# EAGLE design Enclosure 100x68 PBC-AW2 (EAGLE 9.6.1)
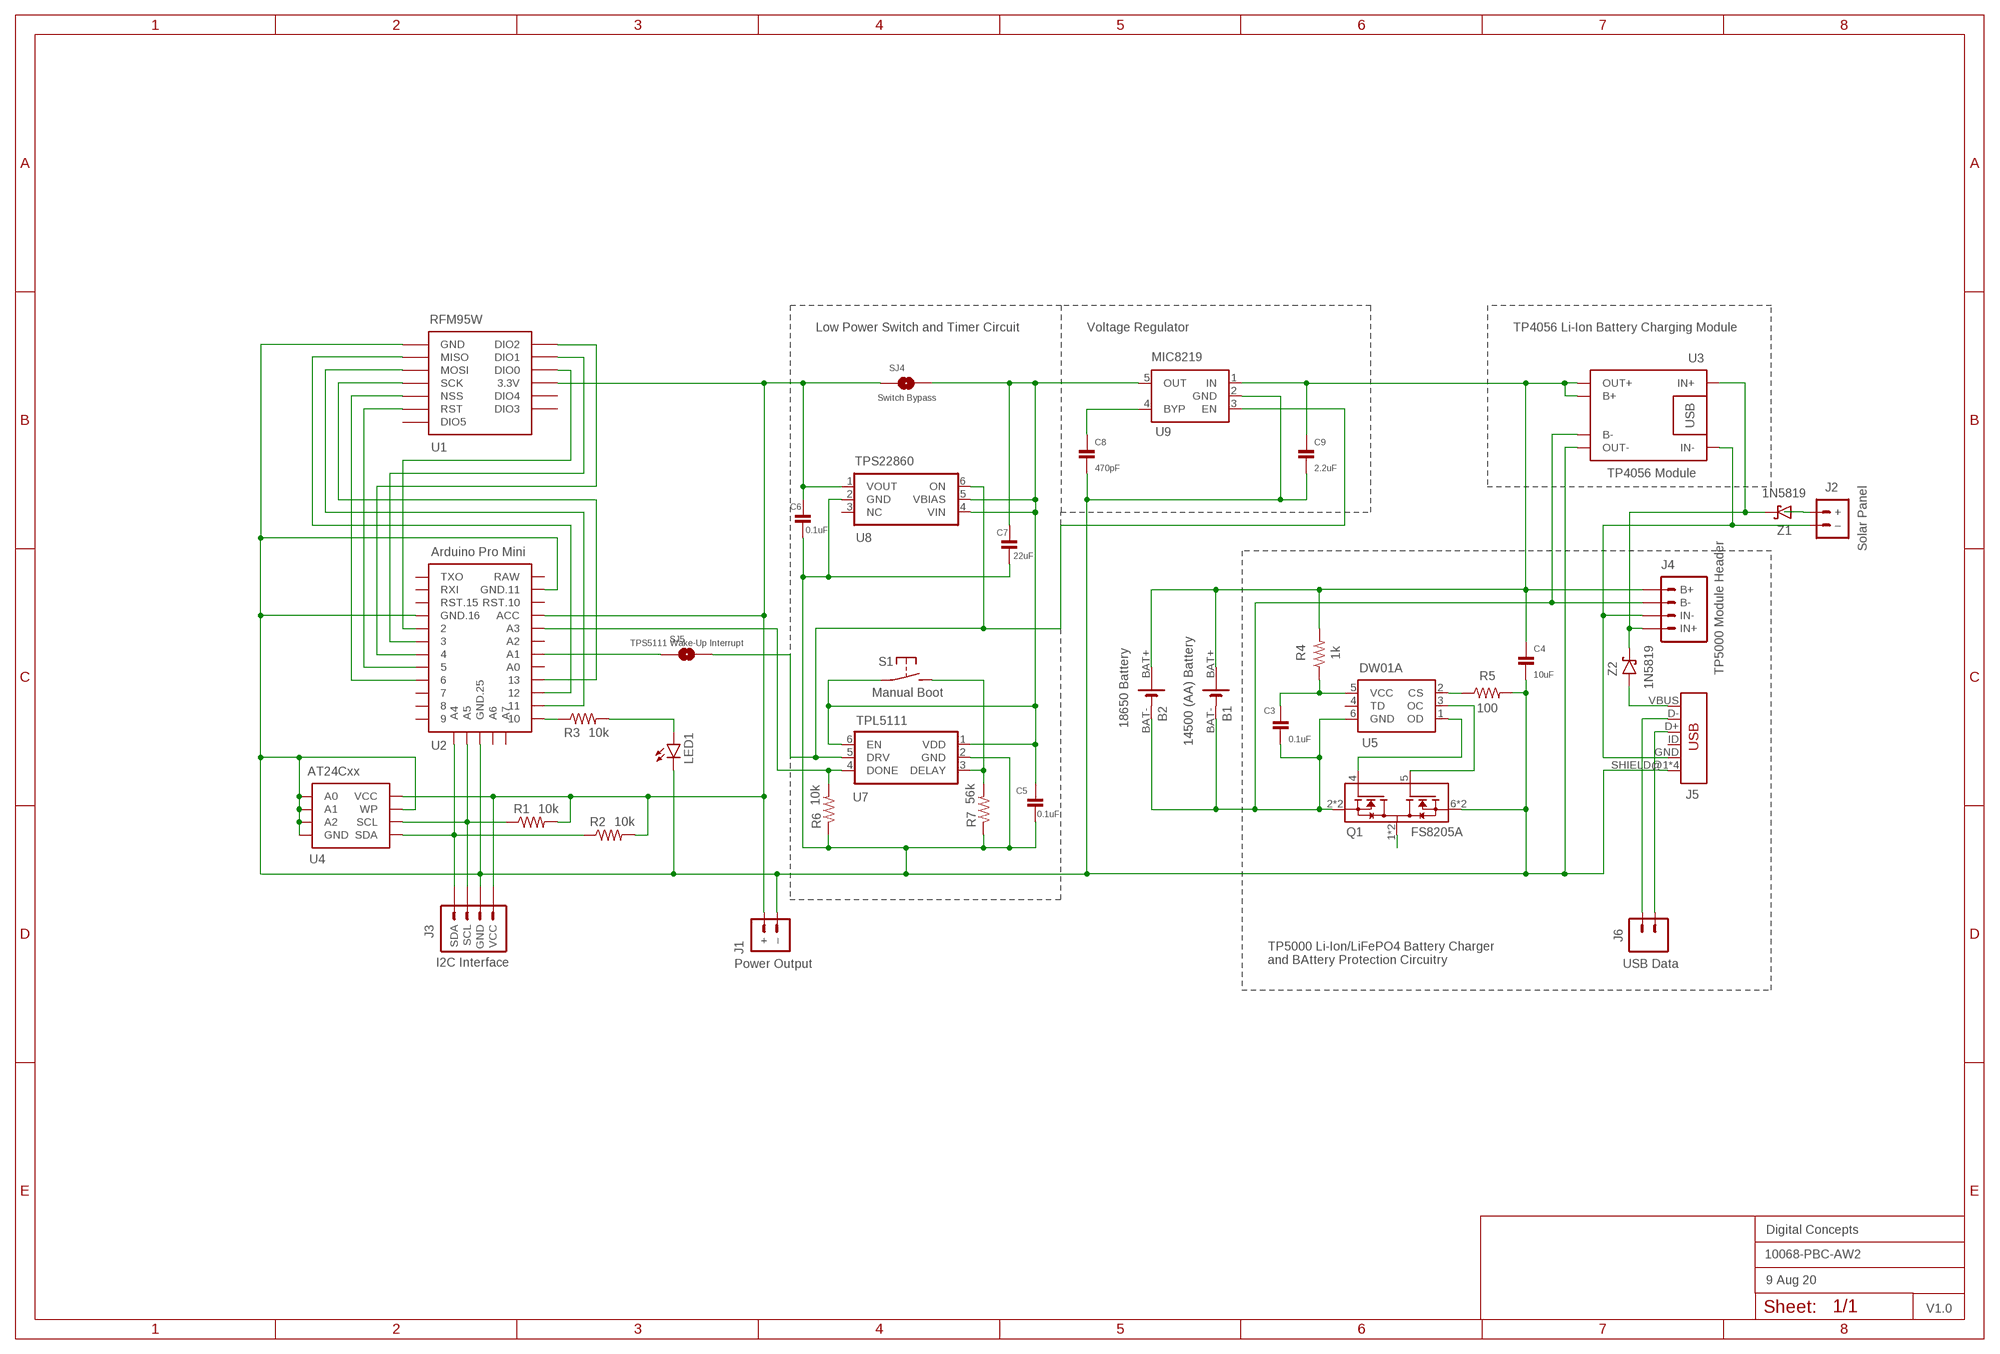
[diagram p0: schematic, sheet 1]
FRAME2 (A3L-LOC): DATE: 9 Aug 20; OWNER: Digital Concepts; TITLE: 10068-PBC-AW2; VERSION: V1.0

## Parts
B1  14500 (AA) Battery  BATTERY-HOLDER-14500(AA)  [BATTERY-14500]
B2  18650 Battery  BATTERY-HOLDER-18650  [BATTERY-18650]
C3  0.1uF  CAPACITOR  [C0805]
C4  10uF  CAPACITOR  [C0805]
C5  0.1uF  CAPACITOR  [C0805]
C6  0.1uF  CAPACITOR  [C0805]
C7  22uF  CAPACITOR  [C0805]
C8  470pF  CAPACITOR  [C0805]
C9  2.2uF  CAPACITOR  [C0805]
J1  Power Output  JST-PH1.25-MALE  [JST-PH1.25]
J2  Solar Panel  JST-PH2.0-MALE  [JST-PH2.0]
J3  I2C Interface  I2C-PIN-HEADER  [CONN_04-GENERIC]
J4  TP5000 Module Header  TP5000-MODULE  [CONN_04-GENERIC]
J5  USB  USB_MINI-B_SMT  [USB-MINIB]
J6  USB Data  1X2-PIN-HEADER  [CONN_02-GENERIC]
LED1  LEDCHIP-LED0805  [CHIP-LED0805]
Q1  FS8205A  [SOP65P640X120-8N]
R1  10k  RESISTORR0805  [R0805]
R2  10k  RESISTORR0805  [R0805]
R3  10k  RESISTORR0805  [R0805]
R4  1k  RESISTORR0805  [R0805]
R5  100  RESISTORR0805  [R0805]
R6  10k  RESISTORR0805  [R0805]
R7  56k  RESISTORR0805  [R0805]
S1  Manual Boot  2-PIN-MOMENTARY-SWITCH  [2-PAD-SWITCH]
SJ4  Switch Bypass  SJ  [SJ]
SJ5  TPS5111 Wake-Up Interrupt  SJ  [SJ]
U1  RFM95W  RFM95W-PI  [RFM95W-PI]
U2  Arduino Pro Mini  ARDUINO-PRO-MINI  [PRO-MINI-29]
U3  TP4056 Module  BATTERY-CHARGER-LI-PROT  [BATTERY-CHARGER-LI-PROT]
U4  AT24Cxx  AT24CXX-EEPROM  [SOP-8]
U5  DW01A  [SOT23-6]
U7  TPL5111  TPL5111DDCR  [SOT-23-6]
U8  TPS22860  [SOT-23-6]
U9  MIC8219  MIC5219XX  [SOT-23-5]
Z1  1N5819  1N5819-SOD-123  [SOD-123]
Z2  1N5819  1N5819-SOD-123  [SOD-123]

## Nets
GND: C4.2 C5.2 C6.2 C7.2 C8.2 C9.2 J1.-(–) J3.2(GND) J5.SHIELD@1(SHIELD) J5.SHIELD@2(SHIELD) J5.SHIELD@3(SHIELD) J5.SHIELD@4(SHIELD) LED1.C Q1.6(S2) Q1.7(S2) R5.2 R6.1 R7.1 U1.GND@3(GND) U1.GND@6(GND) U2.GND@11(GND.25) U2.GND@16(GND.16) U2.GND@25(GND.11) U3.OUT- U4.P$1(A0) U4.P$2(A1) U4.P$3(A2) U4.P$4(GND) U4.P$7(WP) U7.2(GND) U8.2(GND) U9.2(GND)
N$1: J2.+ Z1.A
N$2: J2.-(–) J4.2(IN-) J5.GND U3.IN-
N$3: R5.1 U5.2(CS)
N$4: Q1.1(D12) Q1.8(D12)
N$5: J4.1(IN+) U3.IN+ Z1.C Z2.C
N$6: B1.BAT+ B2.BAT+ C4.1 C9.1 J4.4(B+) R4.2 U3.B+ U3.OUT+ U9.1(IN)
N$7: C8.1 U9.4(BYP)
N$8: J3.3(SCL) R1.1 U2.A5 U4.P$6(SCL)
N$9: U1.MISO U2.12
N$10: U1.MOSI U2.11
N$11: U1.SCK U2.13
N$12: R3.1 U2.10
N$13: U1.RST U2.5
N$14: U1.DIO2 U2.4
N$15: U1.DIO1 U2.3
N$16: U1.DIO0 U2.2
N$17: LED1.A R3.2
N$18: Q1.5(G2) U5.3(OC)
N$19: J5.VBUS Z2.A
N$20: Q1.4(G1) U5.1(OD)
N$21: J5.D+ J6.2
N$22: C3.1 R4.1 U5.5(VCC)
N$23: B1.BAT- B2.BAT- C3.2 J4.3(B-) Q1.2(S1) Q1.3(S1) U3.B- U5.6(GND)
N$24: J5.D- J6.1
N$25: R7.2 S1.P$2(S) U7.3(DELAY)
N$26: C5.1 C7.1 S1.P$1(P) SJ4.2 U7.1(VDD) U7.6(EN) U8.4(VIN) U8.5(VBIAS) U9.5(OUT)
N$27: J3.4(SDA) R2.1 U2.A4 U4.P$5(SDA)
N$28: SJ5.2 U7.5(DRV) U8.6(ON) U9.3(EN)
N$29: R6.2 U2.A3 U7.4(DONE)
N$30: SJ5.1 U2.A1
NSS: U1.NSS U2.6
VCC: C6.1 J1.+ J3.1(VCC) R1.2 R2.2 SJ4.1 U1.3V3(3.3V) U2.ACC U4.P$8(VCC) U8.1(VOUT)
Unconnected: J5.ID U1.DIO3 U1.DIO4 U1.DIO5 U2.7 U2.8 U2.9 U2.A0 U2.A2 U2.A6 U2.A7 U2.RST@10(RST.10) U2.RST@15(RST.15) U2.RXI U2.TXO U5.4(TD) U8.3(NC)

## Notes on the sheet
- Low Power Switch and Timer Circuit | Voltage Regulator | TP4056 Li-Ion Battery Charging Module
- TP5000 Li-Ion/LiFePO4 Battery Charger
  and BAttery Protection Circuitry

## Power pins joined to a net without a drawn wire
RAW: U2.RAW

## Library data of the parts
B1 = digitalconcepts:BATTERY-HOLDER-14500(AA): 14500 (AA) battery holder
B2 = digitalconcepts:BATTERY-HOLDER-18650: 18650 Battery Holder
C3-C9 = digitalconcepts:CAPACITOR: 0805 Capacitor
J1 = digitalconcepts:JST-PH1.25-MALE: PH1.25 Male PCB Connector
J2 = digitalconcepts:JST-PH2.0-MALE: PH2.0 Male PCB Connector
J3 = digitalconcepts:I2C-PIN-HEADER: I2C Interface Pin Header
J4 = digitalconcepts:TP5000-MODULE: TP5000 Module Pin Header
J5 = digitalconcepts:USB_MINI-B: USB Mini-B Connector Breaks out 5 pins, and includes shield pins if needed.
J6 = digitalconcepts:1X2-PIN-HEADER: Single Row 2-Pin Header
LED1 = digitalconcepts:LED: LED OSRAM: - CHIPLED LG R971, LG N971, LY N971, LG Q971, LY Q971, LO R971, LY R971 LH N974, LH R974 LS Q976, LO Q976, LY Q976 LO Q996 - Hyper CHIPLED LW Q18S LB Q993, LB Q99A, LB R99A - SideLED LS A670, LO A670, LY A670, LG A670, LP A670 LB A673, LV A673, LT A673, LW A673 LH A674 LY A675 LS A676, LA A676, LO A676, LY A676, LW A676 LS A679, LY A679, LG A679 - Hyper Micro SIDELED® LS Y876, LA Y876, LO Y876, LY Y876 LT Y87S - SmartLED LW L88C, LW L88S LB L89C, LB L89S, LG L890 LS L89K, LO L89K, LY L89K LS L896, LA L896, LO L896, LY L896 - TOPLED LS T670, LO T670, LY T670, LG T670, LP T670 LSG T670, LSP T670, LSY T670, LOP T670, LYG T670 LG T671, LOG T671, LSG T671 LB T673, LV T673, LT T673, LW T673 LH T674 LS T676, LA T676, LO T676, LY T676, LB T676, LH T676, LSB T676, LW T676 LB T67C, LV T67C, LT T67C, LS T67K, LO T67K, LY T67K, LW E67C LS E67B, LA E67B, LO E67B, LY E67B, LB E67C, LV E67C, LT E67C LW T67C LS T679, LY T679, LG T679 LS T770, LO T770, LY T770, LG T770, LP T770 LB T773, LV T773, LT T773, LW T773 LH T774 LS E675, LA E675, LY E675, LS T675 LS T776, LA T776, LO T776, LY T776, LB T776 LHGB T686 LT T68C, LB T68C - Hyper Mini TOPLED® LB M676 - Mini TOPLED Santana® LG M470 LS M47K, LO M47K, LY M47K Source: http://www.osram.convergy.de LUXEON: - LUMILED® LXK2-PW12-R00, LXK2-PW12-S00, LXK2-PW14-U00, LXK2-PW14-V00 LXK2-PM12-R00, LXK2-PM12-S00, LXK2-PM14-U00 LXK2-PE12-Q00, LXK2-PE12-R00, LXK2-PE12-S00, LXK2-PE14-T00, LXK2-PE14-U00 LXK2-PB12-K00, LXK2-PB12-L00, LXK2-PB12-M00, LXK2-PB14-N00, LXK2-PB14-P00, LXK2-PB14-Q00 LXK2-PR12-L00, LXK2-PR12-M00, LXK2-PR14-Q00, LXK2-PR14-R00 LXK2-PD12-Q00, LXK2-PD12-R00, LXK2-PD12-S00 LXK2-PH12-R00, LXK2-PH12-S00 LXK2-PL12-P00, LXK2-PL12-Q00, LXK2-PL12-R00 Source: www.luxeon.com KINGBRIGHT: KA-3528ASYC Source: www.kingbright.com
Q1 = FS8205A:FS8205A: N/A; AVAILABILITY: Unavailable; MF: Fortune Semiconductor; MP: FS8205A; PACKAGE: Package; PRICE: None
R1-R7 = digitalconcepts:RESISTOR: RESISTOR, American symbol; SPICEPREFIX: R
S1 = digitalconcepts:2-PIN-MOMENTARY-SWITCH: 2 Pin Momentary Switch
SJ4 SJ5 = digitalconcepts:SJ: Solder Jumper
U1 = digitalconcepts:RFM95W-PI: RFM95W LoRa Wireless Transceiver Raspberry Pi Daughter Board
U2 = digitalconcepts:ARDUINO-PRO-MINI: Arduino Pro Mini 29 [+6] Pin 'Clone'
U3 = digitalconcepts:BATTERY-CHARGER-LI-PROT: TP4056 Li Battery Charger module with PCB (rather than module) footprint
U4 = digitalconcepts:AT24CXX-EEPROM: AT24Cxx EEPROM SOP-8
U5 = DW01A:DW01A; AVAILABILITY: Unavailable; DESCRIPTION: One Cell Lithium-ion/Polymer Battery Protection IC; MF: Fortune Semiconductor; MP: DW01A; PACKAGE: SOT-23-6 Fortune Semiconductor; PRICE: None
U7 = TPL5111DDCR:TPL5111DDCR: TPL5111 Nano-Power System Timer
U8 = TPL5111DDCR:TPS22860: Texas Instruments TPS22860 Ultra-Low Leakage Load Switch
U9 = digitalconcepts:MIC5219XX: VOLTAGE REGULATOR; OC_FARNELL: unknown; OC_NEWARK: unknown
Z1 Z2 = digitalconcepts:1N5819-SOD-123: 1N5819 Schottky Diode SOD-123

## Board
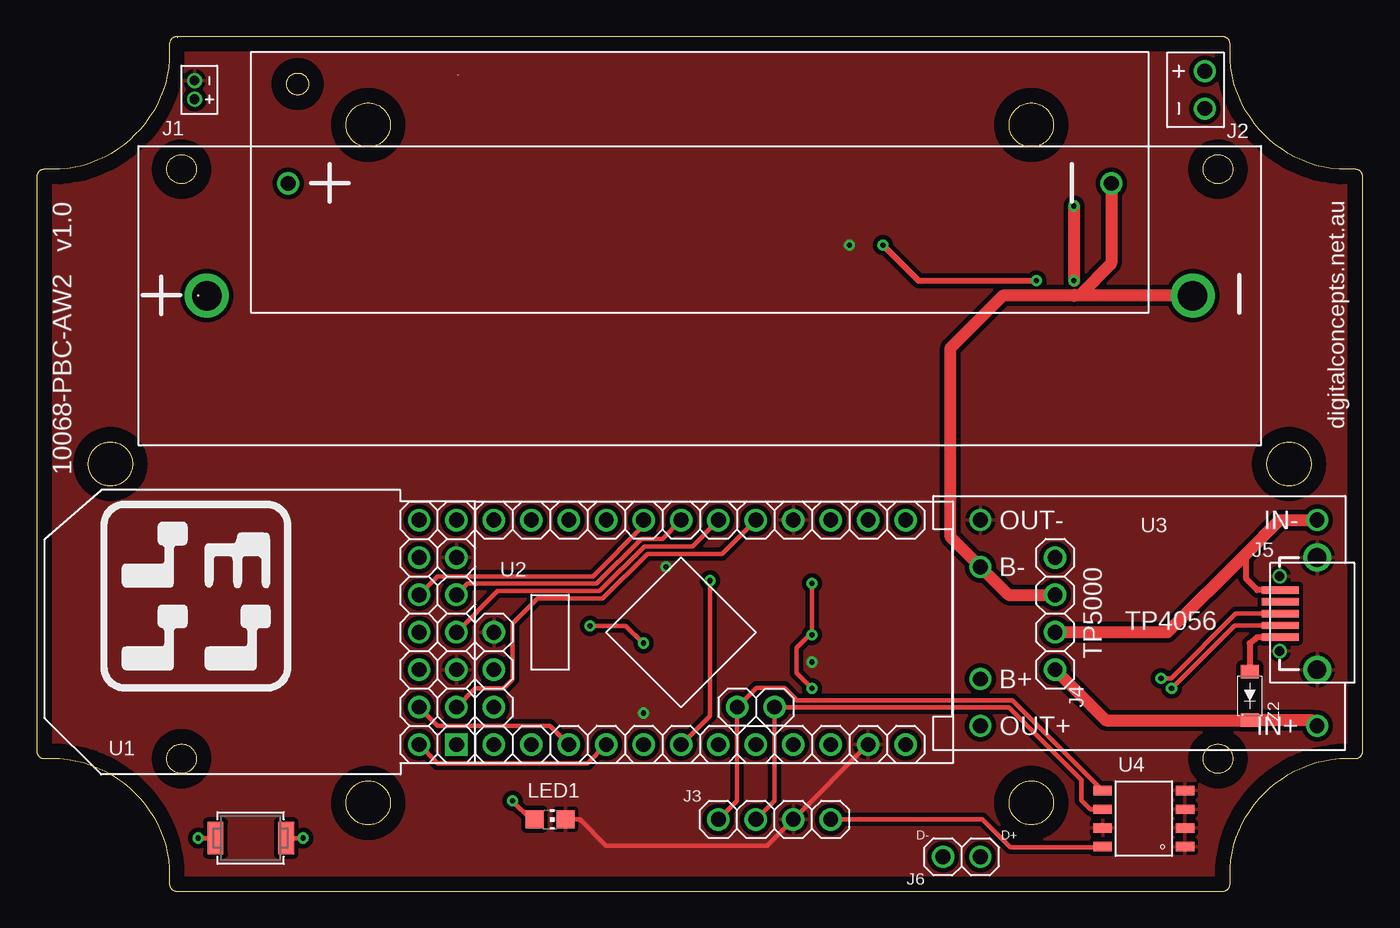
[diagram p1: board, top side]
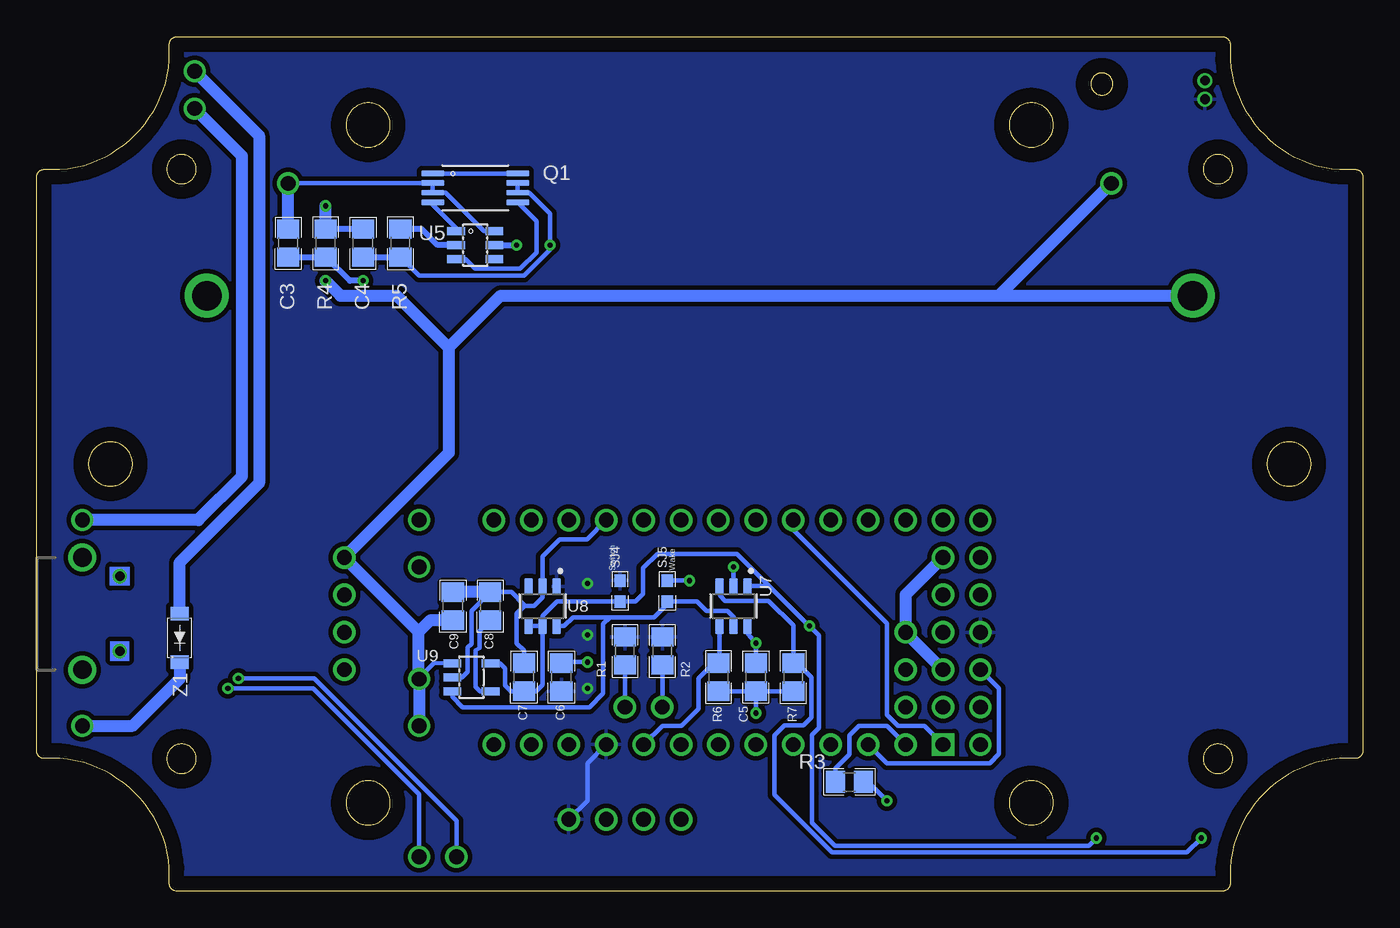
[diagram p2: board, bottom side, seen from below]

Size 90 x 58 mm. Coordinates in mm from the lower left corner, seen from the top.
Outline: 9.4,57.99 9.37,57.98 9.34,57.97 9.31,57.96 9.28,57.95 9.25,57.93 9.22,57.91 9.19,57.9 9.17,57.88 9.15,57.85 9.12,57.83 9.1,57.81 9.09,57.78 9.07,57.75 9.05,57.72 9.03,57.66 9.02,57.63 9.01,57.6 9,57.57 9,57.53 9,56.45 8.94,55.91 8.84,55.39 8.73,54.87 8.57,54.36 8.37,53.89 8.17,53.41 7.92,52.95 7.63,52.53 7.35,52.1 7.02,51.7 6.66,51.34 6.29,50.98 5.9,50.65 5.47,50.37 5.05,50.08 4.59,49.83 4.11,49.63 3.64,49.43 3.13,49.27 2.61,49.16 2.09,49.06 1.55,49 0.46,49 0.43,49 0.4,48.99 0.37,48.98 0.33,48.97 0.3,48.96 0.27,48.95 0.25,48.93 0.22,48.91 0.19,48.9 0.17,48.88 0.15,48.85 0.12,48.83 0.1,48.81 0.08,48.78 0.07,48.75 0.05,48.72 0.04,48.69 0.03,48.66 0.02,48.63 0.01,48.6 0,48.57 0,48.53 0,9.46 0,9.43 0.01,9.4 0.02,9.37 0.03,9.33 0.04,9.3 0.05,9.28 0.07,9.25 0.08,9.22 0.1,9.19 0.12,9.17 0.17,9.12 0.19,9.1 0.22,9.09 0.25,9.07 0.27,9.05 0.3,9.04 0.33,9.03 0.37,9.02 0.4,9.01 0.43,9 0.46,9 1.55,9 2.09,8.94 2.61,8.84 3.13,8.73 3.64,8.57 4.11,8.37 4.59,8.17 5.05,7.92 5.47,7.63 5.9,7.35 6.29,7.02 6.66,6.66 7.02,6.29 7.35,5.9 7.63,5.47 7.92,5.05 8.17,4.59 8.37,4.11 8.57,3.64 8.73,3.13 8.84,2.61 8.94,2.09 9,1.55 9,0.46 9,0.43 9.01,0.4 9.02,0.37 9.03,0.33 9.04,0.31 9.05,0.28 9.07,0.25 9.09,0.22 9.1,0.19 9.12,0.17 9.15,0.15 9.17,0.12 9.19,0.1 9.25,0.07 9.28,0.05 9.31,0.04 9.34,0.03 9.37,0.02 9.4,0.01 9.43,0 9.47,0 80.53,0 80.57,0 80.63,0.02 80.66,0.03 80.69,0.04 80.72,0.05 80.75,0.07 80.78,0.08 80.81,0.1 80.83,0.12 80.85,0.15 80.88,0.17 80.9,0.19 80.91,0.22 80.93,0.25 80.95,0.28 80.96,0.31 80.97,0.33 80.98,0.37 80.99,0.4 81,0.43 81,0.47 81,1.55 81.06,2.09 81.16,2.61 81.27,3.13 81.43,3.64 81.63,4.11 81.83,4.59 82.08,5.05 82.37,5.47 82.65,5.9 82.98,6.3 83.34,6.66 83.7,7.02 84.1,7.35 84.53,7.63 84.95,7.92 85.41,8.17 85.89,8.37 86.36,8.57 86.87,8.73 87.39,8.84 87.91,8.94 88.45,9 89.53,9 89.57,9 89.6,9.01 89.63,9.02 89.66,9.03 89.69,9.04 89.72,9.05 89.75,9.07 89.78,9.09 89.81,9.1 89.83,9.12 89.85,9.15 89.88,9.17 89.9,9.19 89.91,9.22 89.93,9.25 89.95,9.28 89.96,9.31 89.97,9.34 89.98,9.37 89.99,9.4 90,9.43 90,9.47 90,48.53 90,48.57 89.99,48.6 89.98,48.63 89.97,48.66 89.96,48.69 89.95,48.72 89.93,48.75 89.91,48.78 89.9,48.81 89.88,48.83 89.85,48.85 89.83,48.88 89.81,48.9 89.78,48.91 89.75,48.93 89.72,48.95 89.69,48.96 89.66,48.97 89.63,48.98 89.6,48.99 89.57,49 89.53,49 88.45,49 87.91,49.06 87.39,49.16 86.87,49.27 86.36,49.43 85.89,49.63 85.41,49.83 84.95,50.08 84.53,50.37 84.1,50.65 83.7,50.98 82.98,51.7 82.65,52.1 82.37,52.53 82.08,52.95 81.83,53.41 81.63,53.89 81.43,54.36 81.27,54.87 81.16,55.39 81.06,55.91 81,56.45 81,57.53 81,57.57 80.99,57.6 80.98,57.63 80.97,57.66 80.96,57.69 80.95,57.72 80.93,57.75 80.91,57.78 80.9,57.81 80.88,57.83 80.85,57.85 80.83,57.88 80.81,57.9 80.78,57.91 80.75,57.93 80.72,57.95 80.69,57.96 80.66,57.97 80.63,57.98 80.6,57.99 80.57,58 80.53,58 9.47,58 9.43,58 9.4,57.99
Outline: 67.81,7.46 67.9,7.44 68,7.41 68.09,7.37 68.18,7.33 68.26,7.28 68.34,7.23 68.42,7.18 68.5,7.12 68.56,7.05 68.63,6.98 68.69,6.91 68.75,6.83 68.8,6.75 68.85,6.66 68.89,6.57 68.92,6.48 68.95,6.39 68.97,6.29 68.99,6.19 69,6.09 69,5.88 68.99,5.78 68.97,5.69 68.95,5.59 68.92,5.49 68.89,5.4 68.85,5.31 68.8,5.23 68.75,5.15 68.69,5.07 68.63,4.99 68.56,4.93 68.5,4.86 68.42,4.8 68.34,4.74 68.26,4.69 68.18,4.64 68.09,4.61 68,4.57 67.9,4.54 67.81,4.52 67.71,4.5 67.61,4.49 67.4,4.49 67.3,4.5 67.2,4.52 67.1,4.54 67.01,4.57 66.92,4.61 66.83,4.64 66.74,4.69 66.59,4.8 66.51,4.86 66.44,4.93 66.37,4.99 66.31,5.07 66.26,5.15 66.21,5.23 66.16,5.31 66.12,5.4 66.08,5.49 66.05,5.59 66.03,5.69 66.01,5.78 66,5.88 66,6.09 66.01,6.19 66.05,6.39 66.08,6.48 66.12,6.57 66.16,6.66 66.21,6.75 66.26,6.83 66.31,6.91 66.37,6.98 66.44,7.05 66.51,7.12 66.59,7.18 66.67,7.23 66.74,7.28 66.83,7.33 66.92,7.37 67.01,7.41 67.1,7.44 67.2,7.46 67.3,7.48 67.4,7.49 67.61,7.49 67.71,7.48 67.81,7.46
Outline: 22.8,7.46 22.89,7.44 22.99,7.41 23.08,7.37 23.17,7.33 23.25,7.28 23.33,7.23 23.41,7.18 23.49,7.12 23.56,7.05 23.62,6.98 23.68,6.91 23.74,6.83 23.79,6.75 23.84,6.66 23.88,6.57 23.92,6.48 23.94,6.39 23.96,6.29 23.98,6.19 24,6.09 24,5.88 23.98,5.78 23.96,5.69 23.94,5.59 23.92,5.49 23.88,5.4 23.84,5.31 23.79,5.23 23.74,5.15 23.68,5.07 23.62,4.99 23.56,4.93 23.49,4.86 23.41,4.8 23.25,4.69 23.17,4.64 23.08,4.61 22.99,4.57 22.89,4.54 22.8,4.52 22.7,4.5 22.6,4.49 22.39,4.49 22.29,4.5 22.19,4.52 22.1,4.54 22,4.57 21.91,4.61 21.82,4.64 21.74,4.69 21.66,4.74 21.58,4.8 21.5,4.86 21.43,4.93 21.37,4.99 21.3,5.07 21.25,5.15 21.2,5.23 21.15,5.31 21.11,5.4 21.07,5.49 21.05,5.59 21.02,5.69 21.01,5.78 20.99,5.88 20.99,6.09 21.01,6.19 21.02,6.29 21.05,6.39 21.07,6.48 21.11,6.57 21.15,6.66 21.2,6.75 21.25,6.83 21.3,6.91 21.37,6.98 21.43,7.05 21.5,7.12 21.58,7.18 21.66,7.23 21.74,7.28 21.82,7.33 21.91,7.37 22,7.41 22.1,7.44 22.19,7.46 22.29,7.48 22.39,7.49 22.6,7.49 22.7,7.48 22.8,7.46
Outline: 80.38,9.96 80.44,9.95 80.51,9.93 80.57,9.91 80.63,9.88 80.68,9.85 80.74,9.81 80.79,9.78 80.84,9.74 80.89,9.69 80.93,9.65 80.97,9.6 81.01,9.54 81.04,9.49 81.07,9.43 81.1,9.37 81.13,9.31 81.14,9.25 81.16,9.19 81.17,9.12 81.18,9.05 81.18,8.92 81.17,8.85 81.16,8.78 81.14,8.72 81.13,8.66 81.1,8.6 81.07,8.54 81.04,8.48 81.01,8.43 80.97,8.37 80.93,8.32 80.89,8.28 80.84,8.23 80.79,8.19 80.74,8.16 80.68,8.12 80.63,8.09 80.57,8.06 80.51,8.04 80.44,8.02 80.38,8 80.31,7.99 80.25,7.98 80.11,7.98 80.04,7.99 79.98,8 79.91,8.02 79.85,8.04 79.79,8.06 79.73,8.09 79.67,8.12 79.62,8.16 79.57,8.19 79.52,8.23 79.47,8.28 79.43,8.32 79.38,8.37 79.35,8.43 79.31,8.48 79.28,8.54 79.26,8.6 79.23,8.66 79.21,8.72 79.2,8.78 79.19,8.85 79.18,8.92 79.18,9.05 79.19,9.12 79.2,9.19 79.21,9.25 79.23,9.31 79.26,9.37 79.28,9.43 79.31,9.49 79.35,9.54 79.38,9.6 79.43,9.65 79.47,9.69 79.52,9.74 79.57,9.78 79.62,9.81 79.67,9.85 79.73,9.88 79.79,9.91 79.85,9.93 79.91,9.95 79.98,9.96 80.04,9.98 80.11,9.98 80.25,9.98 80.31,9.98 80.38,9.96
Outline: 10.02,9.96 10.09,9.95 10.15,9.93 10.21,9.91 10.27,9.88 10.33,9.85 10.38,9.81 10.43,9.78 10.48,9.74 10.53,9.69 10.57,9.65 10.61,9.6 10.65,9.54 10.69,9.49 10.72,9.43 10.74,9.37 10.77,9.31 10.79,9.25 10.8,9.19 10.81,9.12 10.82,9.05 10.82,8.92 10.81,8.85 10.8,8.78 10.79,8.72 10.77,8.66 10.74,8.6 10.72,8.54 10.69,8.48 10.65,8.43 10.61,8.37 10.57,8.32 10.53,8.28 10.48,8.23 10.43,8.19 10.38,8.16 10.33,8.12 10.27,8.09 10.21,8.06 10.15,8.04 10.09,8.02 10.02,8 9.96,7.99 9.89,7.98 9.75,7.98 9.68,7.99 9.62,8 9.55,8.02 9.49,8.04 9.43,8.06 9.37,8.09 9.31,8.12 9.26,8.16 9.21,8.19 9.16,8.23 9.11,8.28 9.07,8.32 9.03,8.37 8.99,8.43 8.96,8.48 8.92,8.54 8.9,8.6 8.87,8.66 8.85,8.72 8.84,8.78 8.83,8.85 8.82,8.92 8.82,9.05 8.83,9.12 8.84,9.19 8.85,9.25 8.87,9.31 8.9,9.37 8.92,9.43 8.96,9.49 8.99,9.54 9.03,9.6 9.07,9.65 9.11,9.69 9.16,9.74 9.21,9.78 9.26,9.81 9.31,9.85 9.37,9.88 9.43,9.91 9.49,9.93 9.55,9.95 9.62,9.96 9.68,9.98 9.75,9.98 9.89,9.98 9.96,9.98 10.02,9.96
Outline: 85.31,30.47 85.4,30.45 85.5,30.42 85.59,30.38 85.68,30.34 85.76,30.3 85.84,30.24 85.92,30.19 86,30.13 86.06,30.06 86.13,29.99 86.19,29.92 86.25,29.84 86.3,29.76 86.35,29.67 86.39,29.58 86.42,29.49 86.45,29.4 86.47,29.3 86.49,29.2 86.5,29.1 86.5,28.9 86.49,28.8 86.47,28.7 86.45,28.6 86.42,28.51 86.39,28.42 86.35,28.33 86.3,28.24 86.25,28.16 86.19,28.08 86.13,28.01 86.06,27.94 86,27.87 85.92,27.81 85.84,27.76 85.76,27.7 85.68,27.66 85.59,27.62 85.5,27.58 85.4,27.55 85.31,27.53 85.21,27.51 85.11,27.5 84.9,27.5 84.8,27.51 84.7,27.53 84.6,27.55 84.51,27.58 84.42,27.62 84.33,27.66 84.25,27.7 84.17,27.76 84.09,27.81 84.01,27.87 83.94,27.94 83.88,28.01 83.81,28.08 83.76,28.16 83.71,28.24 83.66,28.33 83.62,28.42 83.58,28.51 83.55,28.6 83.54,28.7 83.52,28.8 83.5,28.9 83.5,29.1 83.52,29.2 83.54,29.3 83.55,29.4 83.58,29.49 83.62,29.58 83.66,29.67 83.71,29.76 83.76,29.84 83.81,29.92 83.88,29.99 83.94,30.06 84.01,30.13 84.09,30.19 84.17,30.24 84.25,30.3 84.33,30.34 84.42,30.38 84.51,30.42 84.6,30.45 84.7,30.47 84.8,30.49 84.9,30.5 85.11,30.5 85.21,30.49 85.31,30.47
Outline: 5.3,30.47 5.39,30.45 5.49,30.42 5.67,30.34 5.75,30.3 5.83,30.24 5.91,30.19 5.99,30.13 6.06,30.06 6.12,29.99 6.18,29.92 6.24,29.84 6.29,29.76 6.34,29.67 6.41,29.49 6.44,29.4 6.46,29.3 6.48,29.2 6.49,29.1 6.49,28.9 6.48,28.8 6.46,28.7 6.44,28.6 6.41,28.51 6.38,28.42 6.34,28.33 6.29,28.24 6.24,28.16 6.18,28.08 6.12,28.01 6.06,27.94 5.99,27.87 5.91,27.81 5.83,27.76 5.75,27.7 5.67,27.66 5.58,27.62 5.49,27.58 5.39,27.55 5.3,27.53 5.2,27.51 5.1,27.5 4.89,27.5 4.79,27.51 4.69,27.53 4.59,27.55 4.5,27.58 4.41,27.62 4.32,27.66 4.24,27.7 4.16,27.76 4.08,27.81 4,27.87 3.93,27.94 3.87,28.01 3.8,28.08 3.75,28.16 3.7,28.24 3.65,28.33 3.61,28.42 3.57,28.51 3.54,28.6 3.52,28.7 3.5,28.8 3.49,28.9 3.49,29.1 3.5,29.2 3.52,29.3 3.54,29.4 3.57,29.49 3.61,29.58 3.65,29.67 3.7,29.76 3.75,29.84 3.8,29.92 3.87,29.99 3.93,30.06 4,30.13 4.08,30.19 4.16,30.24 4.24,30.3 4.32,30.34 4.5,30.42 4.59,30.45 4.69,30.47 4.79,30.49 4.89,30.5 5.1,30.5 5.2,30.49 5.3,30.47
Outline: 80.38,49.99 80.44,49.98 80.51,49.96 80.57,49.94 80.63,49.91 80.68,49.88 80.74,49.84 80.79,49.81 80.84,49.77 80.93,49.68 80.97,49.63 81.01,49.57 81.04,49.52 81.07,49.46 81.1,49.4 81.13,49.34 81.14,49.28 81.16,49.22 81.17,49.15 81.18,49.08 81.18,48.95 81.17,48.88 81.16,48.81 81.14,48.75 81.13,48.69 81.1,48.63 81.07,48.57 81.04,48.51 81.01,48.46 80.97,48.4 80.93,48.35 80.84,48.26 80.79,48.22 80.74,48.19 80.68,48.15 80.63,48.12 80.57,48.09 80.51,48.07 80.44,48.05 80.38,48.03 80.31,48.02 80.25,48.01 80.11,48.01 80.04,48.02 79.98,48.03 79.91,48.05 79.85,48.07 79.79,48.09 79.73,48.12 79.67,48.15 79.62,48.19 79.57,48.22 79.52,48.26 79.43,48.35 79.38,48.4 79.35,48.46 79.31,48.51 79.28,48.57 79.26,48.63 79.23,48.69 79.21,48.75 79.2,48.81 79.19,48.88 79.18,48.95 79.18,49.08 79.19,49.15 79.2,49.22 79.21,49.28 79.23,49.34 79.26,49.4 79.28,49.46 79.31,49.52 79.35,49.57 79.38,49.63 79.43,49.68 79.52,49.77 79.57,49.81 79.62,49.84 79.67,49.88 79.73,49.91 79.79,49.94 79.85,49.96 79.91,49.98 79.98,49.99 80.04,50.01 80.11,50.01 80.25,50.01 80.31,50.01 80.38,49.99
Outline: 10.02,49.99 10.09,49.98 10.15,49.96 10.21,49.94 10.27,49.91 10.33,49.88 10.38,49.84 10.43,49.81 10.48,49.77 10.53,49.72 10.57,49.68 10.61,49.63 10.65,49.57 10.69,49.52 10.72,49.46 10.74,49.4 10.77,49.34 10.79,49.28 10.8,49.22 10.81,49.15 10.82,49.08 10.82,48.95 10.81,48.88 10.8,48.81 10.79,48.75 10.77,48.69 10.74,48.63 10.72,48.57 10.69,48.51 10.65,48.46 10.61,48.4 10.57,48.35 10.53,48.31 10.48,48.26 10.43,48.22 10.38,48.19 10.33,48.15 10.27,48.12 10.21,48.09 10.15,48.07 10.09,48.05 10.02,48.03 9.96,48.02 9.89,48.01 9.75,48.01 9.68,48.02 9.62,48.03 9.55,48.05 9.49,48.07 9.43,48.09 9.37,48.12 9.31,48.15 9.26,48.19 9.21,48.22 9.16,48.26 9.11,48.31 9.07,48.35 9.03,48.4 8.99,48.46 8.96,48.51 8.92,48.57 8.9,48.63 8.87,48.69 8.85,48.75 8.84,48.81 8.83,48.88 8.82,48.95 8.82,49.08 8.83,49.15 8.84,49.22 8.85,49.28 8.87,49.34 8.9,49.4 8.92,49.46 8.96,49.52 8.99,49.57 9.03,49.63 9.07,49.68 9.11,49.72 9.16,49.77 9.21,49.81 9.26,49.84 9.31,49.88 9.37,49.91 9.43,49.94 9.49,49.96 9.55,49.98 9.62,49.99 9.68,50.01 9.75,50.01 9.89,50.01 9.96,50.01 10.02,49.99
Outline: 22.19,50.54 22.1,50.56 22,50.59 21.91,50.63 21.82,50.67 21.74,50.71 21.66,50.77 21.58,50.82 21.5,50.88 21.43,50.95 21.37,51.02 21.31,51.09 21.25,51.17 21.2,51.25 21.15,51.34 21.11,51.43 21.07,51.52 21.05,51.61 21.03,51.71 21.01,51.81 21,51.91 21,52.12 21.01,52.22 21.03,52.31 21.05,52.41 21.07,52.51 21.11,52.6 21.15,52.69 21.2,52.77 21.25,52.85 21.31,52.93 21.37,53.01 21.43,53.07 21.5,53.14 21.58,53.2 21.66,53.26 21.74,53.31 21.82,53.36 21.91,53.39 22,53.43 22.1,53.46 22.19,53.48 22.29,53.5 22.39,53.51 22.6,53.51 22.7,53.5 22.8,53.48 22.89,53.46 22.99,53.43 23.08,53.39 23.17,53.36 23.25,53.31 23.33,53.26 23.41,53.2 23.49,53.14 23.56,53.07 23.62,53.01 23.68,52.93 23.74,52.85 23.79,52.77 23.84,52.69 23.88,52.6 23.91,52.51 23.94,52.41 23.96,52.31 23.98,52.22 24,52.12 24,51.91 23.98,51.81 23.96,51.71 23.94,51.61 23.91,51.52 23.88,51.43 23.84,51.34 23.79,51.25 23.74,51.17 23.68,51.09 23.62,51.02 23.56,50.95 23.49,50.88 23.41,50.82 23.33,50.77 23.25,50.71 23.17,50.67 23.08,50.63 22.99,50.59 22.89,50.56 22.8,50.54 22.7,50.52 22.6,50.51 22.39,50.51 22.29,50.52 22.19,50.54
Outline: 67.81,53.48 67.9,53.46 68,53.43 68.09,53.39 68.18,53.36 68.26,53.31 68.34,53.26 68.42,53.2 68.5,53.14 68.63,53.01 68.69,52.93 68.75,52.85 68.8,52.77 68.85,52.69 68.89,52.6 68.92,52.51 68.95,52.41 68.97,52.31 68.99,52.22 69,52.12 69,51.91 68.99,51.81 68.97,51.71 68.95,51.61 68.92,51.52 68.89,51.43 68.85,51.34 68.8,51.25 68.75,51.17 68.69,51.09 68.63,51.02 68.5,50.88 68.42,50.82 68.34,50.77 68.26,50.71 68.18,50.67 68.09,50.63 68,50.59 67.9,50.56 67.81,50.54 67.71,50.52 67.61,50.51 67.4,50.51 67.3,50.52 67.2,50.54 67.1,50.56 67.01,50.59 66.92,50.63 66.83,50.67 66.75,50.71 66.67,50.77 66.59,50.82 66.51,50.88 66.44,50.95 66.37,51.02 66.31,51.09 66.26,51.17 66.21,51.25 66.16,51.34 66.12,51.43 66.08,51.52 66.05,51.61 66.03,51.71 66.01,51.81 66,51.91 66,52.12 66.01,52.22 66.03,52.31 66.05,52.41 66.08,52.51 66.12,52.6 66.16,52.69 66.21,52.77 66.26,52.85 66.31,52.93 66.37,53.01 66.44,53.07 66.51,53.14 66.59,53.2 66.67,53.26 66.75,53.31 66.83,53.36 66.92,53.39 67.01,53.43 67.1,53.46 67.2,53.48 67.3,53.5 67.4,53.51 67.61,53.51 67.71,53.5 67.81,53.48
Outline: 17.85,55.53 17.9,55.52 17.95,55.5 17.99,55.48 18.04,55.46 18.08,55.44 18.12,55.41 18.16,55.39 18.2,55.36 18.23,55.32 18.27,55.29 18.3,55.25 18.32,55.21 18.35,55.17 18.37,55.13 18.39,55.08 18.41,55.04 18.43,54.99 18.44,54.94 18.45,54.89 18.45,54.84 18.45,54.74 18.45,54.69 18.44,54.64 18.43,54.59 18.41,54.55 18.39,54.5 18.37,54.46 18.35,54.41 18.32,54.37 18.3,54.33 18.27,54.3 18.23,54.26 18.2,54.23 18.16,54.2 18.12,54.17 18.08,54.14 18.04,54.12 17.99,54.1 17.95,54.08 17.9,54.07 17.85,54.06 17.8,54.05 17.75,54.04 17.65,54.04 17.6,54.05 17.55,54.06 17.5,54.07 17.45,54.08 17.41,54.1 17.37,54.12 17.32,54.14 17.28,54.17 17.24,54.2 17.21,54.23 17.17,54.26 17.14,54.3 17.11,54.33 17.08,54.37 17.05,54.41 17.03,54.46 17.01,54.5 16.99,54.55 16.98,54.59 16.97,54.64 16.96,54.69 16.95,54.74 16.95,54.84 16.96,54.89 16.97,54.94 16.98,54.99 16.99,55.04 17.01,55.08 17.03,55.13 17.05,55.17 17.08,55.21 17.11,55.25 17.14,55.29 17.17,55.32 17.21,55.36 17.24,55.39 17.28,55.41 17.32,55.44 17.37,55.46 17.41,55.48 17.45,55.5 17.5,55.52 17.55,55.53 17.6,55.54 17.65,55.54 17.75,55.54 17.8,55.54 17.85,55.53
Copper layers (1*16): Top 0.035mm / dielectric 1.5mm / Bottom 0.035mm
Design rules "default *": minimum track width 6mil, minimum drill 0.35mm, track to track 6mil, track to pad 6mil, pad to pad 6mil, via to via 6mil, smd to smd 6mil, copper to edge 40mil, drill to drill 6mil, minimum pad ring 1mil, minimum via ring 8mil, stop-mask expansion 4mil, vias tented up to drill 0mil, thermal gap 10mil

### Footprints (pad centres in the part's own frame; a part is rotated, then mirrored left to right if it is on the bottom)
BATTERY-14500 = drill 1: BAT+ -27.94,0; BAT- 27.94,0
BATTERY-18650 = drill 2: BAT+ -33.465,0; BAT- 33.465,0
C0805 = smd 1.3 x 1.5: 1 -0.95,0; 2 0.95,0
JST-PH1.25 = drill 0.65 pad 1.016: + -0.635,0; - 0.635,0
JST-PH2.0 = drill 1: + -1.27,0; - 1.27,0
CONN_04-GENERIC = drill 1 pad 1.524: 1 0,0; 2 2.54,0; 3 5.08,0; 4 7.62,0
USB-MINIB = smd 2.5 x 0.5: D+ 2.5,0; D- 2.5,0.8; GND 2.5,-1.6; ID 2.5,-0.8; VBUS 2.5,1.6 | drill 1.27: SHIELD@1 0,3.81; SHIELD@2 0,-3.81 | drill 0.65 pad 0.762: SHIELD@3 2.54,2.54; SHIELD@4 2.54,-2.54
CONN_02-GENERIC = drill 1 pad 1.524: 1 0,0; 2 2.54,0
CHIP-LED0805 = smd 1.2 x 1.2: A 0,-1.05; C 0,1.05
SOP65P640X120-8N = smd 1.56 x 0.4: 1 -2.88,0.975; 2 -2.88,0.325; 3 -2.88,-0.325; 4 -2.88,-0.975; 5 2.88,-0.975; 6 2.88,-0.325; 7 2.88,0.325; 8 2.88,0.975
R0805 = smd 1.3 x 1.5: 1 -0.95,0; 2 0.95,0
2-PAD-SWITCH = smd 1.067 x 2.184: P$1 -2.4,0; P$2 2.4,0
SJ = smd 0.864 x 0.762: 1 -0.711,0; 2 0.711,0
RFM95W-PI = drill 1 pad 1.524: 3V3 7.62,2.54; DIO0 2.54,0; DIO1 7.62,0; DIO2 10.16,0; DIO3 12.7,2.54; DIO4 15.24,2.54; DIO5 15.24,0; GND@3 5.08,0; GND@6 12.7,0; MISO 2.54,2.54; MOSI 5.08,2.54; RST 10.16,2.54; SCK 0,2.54 | drill 1 pad 1.524 square: NSS 0,0
PRO-MINI-29 = drill 1 pad 1.524: 2 17.78,7.62; 3 15.24,7.62; 4 12.7,7.62; 5 10.16,7.62; 6 7.62,7.62; 7 5.08,7.62; 8 2.54,7.62; 9 0,7.62; 10 0,-7.62; 11 2.54,-7.62; 12 5.08,-7.62; 13 7.62,-7.62; A0 10.16,-7.62; A1 12.7,-7.62; A2 15.24,-7.62; A3 17.78,-7.62; A4 16.51,-5.08; A5 19.05,-5.08; A6 0,-2.54; A7 0,-5.08; ACC 20.32,-7.62; GND@11 25.4,-7.62; GND@16 20.32,7.62; GND@25 0,0; RAW 27.94,-7.62; RST@10 22.86,-7.62; RST@15 22.86,7.62; RXI 25.4,7.62; TXO 27.94,7.62
BATTERY-CHARGER-LI-PROT = drill 1: B+ 10.795,3.81; B- 10.795,-3.81; IN+ -12.065,6.985; IN- -12.065,-6.985; OUT+ 10.795,6.985; OUT- 10.795,-6.985
SOP-8 = smd 0.635 x 1.27: P$1 -1.905,-2.794; P$2 -0.635,-2.794; P$3 0.635,-2.794; P$4 1.905,-2.794; P$5 1.905,2.794; P$6 0.635,2.794; P$7 -0.635,2.794; P$8 -1.905,2.794
SOT23-6 = smd 0.55 x 1.2: 1 -0.95,-1.3; 2 0,-1.3; 3 0.95,-1.3; 4 0.95,1.3; 5 0,1.3; 6 -0.95,1.3
SOT-23-6 = smd 1.1 x 0.6: 1 -1.35,0.95; 2 -1.35,0; 3 -1.35,-0.95; 4 1.35,-0.95; 5 1.35,0; 6 1.35,0.95
SOT-23-5 = smd 0.55 x 1.2: 1 -0.95,-1.3; 2 0,-1.3; 3 0.95,-1.3; 4 0.95,1.3; 5 -0.95,1.3
SOD-123 = smd 0.91 x 1.22: A -1.65,0; C 1.65,0

### Placement (x,y rotation side)
B1  45,48.05 0 top
B2  45,40.43 0 top
C3  72.94,43.99 90 bottom
C4  67.86,43.99 270 bottom
C5  41.19,14.52 270 bottom
C6  54.4,14.52 90 bottom
C7  56.94,14.52 90 bottom
C8  59.22,19.35 90 bottom
C9  61.76,19.35 90 bottom
J1  10.71,54.4 90 top
J2  79.29,54.4 270 top
J3  53.89,4.87 180 top
J4  69.13,15.03 90 top
J5  86.91,18.84 180 top
J6  64.05,2.33 180 top
LED1  34.84,4.87 270 top
Q1  60.24,47.74 0 bottom
R1  50.08,16.3 90 bottom
R2  47.54,16.3 90 bottom
R3  34.84,7.41 0 bottom
R4  70.4,43.99 90 bottom
R5  65.32,43.99 270 bottom
R6  43.73,14.52 90 bottom
R7  38.65,14.52 90 bottom
S1  14.52,3.6 180 top
SJ4  50.41,20.36 270 bottom
SJ5  47.21,20.36 270 bottom
U1  28.49,9.95 90 top
U2  31.03,17.57 0 top
U3  74.84,18.2 180 top
U4  75.15,4.92 90 top
U5  60.24,43.86 270 bottom
U7  42.71,19.35 270 bottom
U8  55.67,19.35 270 bottom
U9  60.49,14.52 270 bottom
Z1  80.31,17.19 270 bottom
Z2  82.34,13.25 270 top

### Tracks (layer width: path | path; a pad name or v marks a point on that pad's centre or on a via)
GND  (via drill 0.35)
  Top 0.305: U2.GND@11 J3.2 49.57,3.09 38.65,3.09 36.87,4.87 LED1.C
  Bottom 0.152: 56.91,19.34 56.91,19.43
  Bottom 0.305: R7.1 C5.2 | C5.2 R6.1 | v42.71,22.01 U7.2 | C7.2 56.94,16.32 57.42,16.81 57.42,18.85 56.91,19.34 56.91,19.35 56.25,19.35 55.67,19.93 U8.2 55.67,22.74 54.52,23.88 52.66,23.88 U2.GND@16 | C6.2 54.83,15.55 v52.62,15.55 | C5.2 v41.19,12.08 | R5.2 64.06,41.78 56.93,41.78 55.16,43.55 v55.16,43.86 55.16,45.98 56.59,47.41 Q1.6 Q1.7 | U9.2 61.13,14.52 60.77,14.88 60.77,16.54 60.49,16.78 60.49,19.03 C8.2 57.79,20.3 56.91,19.43
  Bottom 0.406: C4.2 R5.2
  Bottom 0.813: U1.GND@3 U2.GND@25 31.03,20.11 U1.GND@6 | C8.2 C9.2
  pour Top (isolate 0.305): -1.48,59.48 -1.48,-1.48 91.61,-1.48 91.61,59.48
N$1
  Bottom 0.813: J2.+ 74.91,51.29 74.91,27.69 80.33,22.27 80.33,18.86 Z1.A
N$2
  Top 0.406: 82.08,22.9 82.08,21.2 82.85,20.44 J5.GND
  Top 0.813: U3.IN- 84.37,25.19 82.08,22.9 76.75,17.57 J4.2
  Bottom 0.813: U3.IN- 79.04,25.19 76.06,28.16 76.06,49.9 J2.-
N$3
  Bottom 0.406: R5.1 63.86,44.94 62.78,43.86 U5.2
N$4
  Bottom 0.305: Q1.8 Q1.1
N$5
  Top 0.813: J4.1 72.56,11.6 Z2.C 86.53,11.6 U3.IN+
  Bottom 0.813: U3.IN+ 83.48,11.22 80.31,14.4 Z1.C
N$6  (via drill 0.35)
  Top 0.813: v70.4,46.53 v70.4,41.45
  Bottom 0.305: U3.B+ 64.07,14.41 64.07,14.44 63.02,15.49 U9.1
  Bottom 0.406: C4.1 R4.2
  Bottom 0.813: R4.2 v70.4,46.53 | 62.02,36.87 65.57,40.43 69.38,40.43 v70.4,41.45 | U3.OUT+ U3.B+ 64.07,14.42 64.07,17.59 | B1.BAT+ 24.68,40.43 | 24.68,40.43 58.51,40.43 62.02,36.92 62.02,36.87 | 24.68,40.43 B2.BAT+ | 62.02,36.87 62.02,29.76 J4.4 64.07,17.59 | 64.07,17.59 63.27,18.4 C9.1
N$7
  Bottom 0.305: U9.4 59.89,13.57 60.2,13.88 60.2,16.33 59.96,16.5 59.96,17.66 C8.1
N$8
  Top 0.305: J3.3 50.08,6.14 U2.A5 65.98,12.49 70.91,7.56 70.91,6.16 71.52,5.56 U4.P$6
  Bottom 0.305: R1.1 U2.A5
N$9
  Top 0.305: U1.MISO 27.22,11.22 34.84,11.22 U2.12
N$10
  Bottom 0.305: U1.MOSI 24.68,13.76 24.68,9.31 25.31,8.68 32.3,8.68 U2.11
N$11
  Top 0.305: U1.SCK 27.22,8.68 37.38,8.68 U2.13
N$12
  Bottom 0.305: U2.10 32.3,11.22 34.2,11.22 34.84,10.58 34.84,9.3 35.79,8.35 R3.1
N$13
  Top 0.305: U1.RST 27.22,21.38 37.76,21.38 41.19,24.81 U2.5
N$14
  Top 0.305: U1.DIO2 29.25,20.87 37.99,20.87 41.04,23.92 42.46,23.92 U2.4
N$15
  Top 0.305: U1.DIO1 31.28,20.36 38.19,20.36 41.24,23.41 44.49,23.41 U2.3
N$16
  Top 0.305: U1.DIO0 29.76,13.76 31.69,13.76 32.3,14.37 32.3,18.18 33.98,19.86 38.41,19.86 41.46,22.9 46.52,22.9 U2.2
N$17  (via drill 0.35)
  Top 0.305: v32.3,6.14 32.3,6.11 33.54,4.87 LED1.A
  Bottom 0.305: v32.3,6.14 33.57,7.41 R3.2
N$18
  Bottom 0.305: Q1.5 56.09,45.5 56.09,43.36 57.2,42.25 60.24,42.25 60.9,42.91 U5.3
N$19
  Top 0.406: J5.VBUS 82.85,17.24 82.34,16.83 Z2.A
N$20
  Bottom 0.305: Q1.4 63.12,46.59 61.54,45.01 U5.1
N$21  (via drill 0.35)
  Top 0.305: J5.D+ 81.4,18.84 77,14.45 v76.32,14.45
  Bottom 0.305: v76.32,14.45 71.19,14.45 61.51,4.77 J6.2
N$22  (via drill 0.35)
  Top 0.406: v57.45,43.86 59.86,41.45 v67.86,41.45
  Bottom 0.406: C3.1 R4.1 70.38,43.02 70.32,43.02 68.75,41.45 v67.86,41.45 | U5.5 v57.45,43.86
N$23
  Top 0.305: 78.41,40.48 B2.BAT-
  Top 0.813: J4.3 65.95,20.11 U3.B- 62.02,24.05 62.02,36.87 65.57,40.43 70.4,40.43 70.45,40.48 70.8,40.48 | B1.BAT- 72.94,42.62 70.8,40.48 | 70.8,40.48 78.41,40.48
  Bottom 0.305: U5.6 59.65,44.81 62.25,47.41 Q1.3 Q1.2 63.14,48.05 B1.BAT-
  Bottom 0.813: C3.2 B1.BAT-
N$24  (via drill 0.35)
  Top 0.305: J5.D- 81.31,18.04 v77.03,13.76
  Bottom 0.305: v77.03,13.76 71.24,13.76 64.05,6.57 J6.1
N$25  (via drill 0.35)
  Top 0.305: v10.96,3.6 S1.P$2
  Bottom 0.305: v10.96,3.6 11.93,2.63 36.03,2.63 39.92,6.52 39.92,10.57 39.25,11.24 37.96,11.24 37.4,11.8 37.4,14.51 38.37,15.47 R7.2 38.65,18.03 40.33,19.7 43.27,19.7 43.63,20.06 U7.3
N$26  (via drill 0.35)
  Top 0.305: v37.56,18 39.94,18 v41.19,16.83 | v18.08,3.6 S1.P$1
  Bottom 0.305: v18.08,3.6 18.58,3.09 35.83,3.09 37.38,4.64 37.38,10.61 36.92,11.07 36.92,17.37 v37.56,18 37.58,18 40.29,20.71 | C5.1 v41.19,16.83 41.74,17.46 U7.6 | U8.5 55.67,14 56.1,13.57 C7.1 57.8,13.57 58.21,13.98 58.21,15.12 58.56,15.47 U9.5 | 40.29,20.71 42.48,22.9 47.88,22.9 48.83,21.95 48.83,20.18 49.37,19.65 SJ4.2 54.7,19.65 55.67,18.69 U8.5 | U8.5 U8.4 | U7.1 40.29,20.71
N$27
  Top 0.305: J3.4 47.54,6.14 U2.A4 48.83,13.78 50.77,13.78 51.6,12.95 66.21,12.95 71.71,7.45 72.33,6.83 U4.P$5
  Bottom 0.305: R2.1 U2.A4
N$28
  Bottom 0.203: U7.5 42.68,18.2
  Bottom 0.305: U8.6 54.21,18 53.61,18.6 51.1,18.6 | 42.68,18.2 42.68,18.59 43.11,19.02 44.56,19.02 45.19,19.65 SJ5.2 47.23,19.46 48.1,18.6 51.1,18.6 | 51.1,18.6 51.55,18.14 51.55,13.43 52.49,12.49 61.1,12.49 61.79,13.18 U9.3
N$29
  Bottom 0.305: U7.4 43.66,15.47 R6.2 44.05,15.47 45.08,14.45 45.08,12.39 46.24,11.22 47.54,11.22 U2.A3
N$30  (via drill 0.35)
  Top 0.305: v45.69,21.07 45.69,11.89 43.75,9.95 U2.A1
  Bottom 0.305: v45.69,21.07 SJ5.1
NSS
  Bottom 0.305: U1.NSS 29.76,11.22 31.54,11.22 32.3,11.98 32.3,18.18 38.65,24.53 U2.6
VCC  (via drill 0.35)
  Top 0.305: U4.P$8 72.33,2.99 66.08,2.99 64.2,4.87 J3.1 | v52.62,20.9 v52.62,17.39 52.44,17.39 51.55,16.5 51.55,14.83 v52.62,13.76
  Bottom 0.305: J3.1 52.62,6.14 52.62,8.68 U2.ACC
  pour Bottom (isolate 0.305): -0.21,58.21 -0.21,-0.21 90.34,-0.21 90.34,58.21

### Text on the board
tPlace: J1 | J2 | digitalconcepts.net.au | 10068-PBC-AW2 v1.0 | TP4056 | TP5000 | D- | D+
bPlace: Wake | Switch